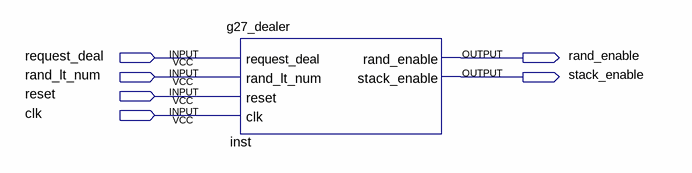
[diagram p0: schematic sheet]
// Quartus schematic deal_schematic.bdf as structural Verilog: 1 symbols, 6 pins
module deal_schematic (
  input  request_deal,
  input  rand_lt_num,
  input  reset,
  input  clk,
  output rand_enable,
  output stack_enable
);

  g27_dealer inst (
    .request_deal(request_deal), .rand_lt_num(rand_lt_num), .reset(reset), .clk(clk),
    .rand_enable(rand_enable), .stack_enable(stack_enable));
endmodule
